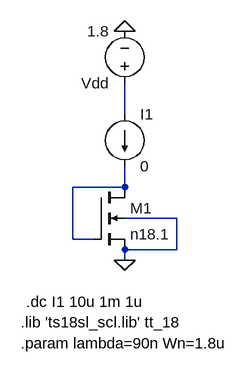
[diagram p0: schematic q2.asc]
q2.asc, the LTspice schematic file:
Version 4.1
SHEET 1 1088 680
WIRE 176 -64 176 -112
WIRE 176 48 176 16
WIRE 176 48 96 48
WIRE 256 96 176 96
WIRE 96 128 96 48
WIRE 128 128 96 128
WIRE 256 144 256 96
WIRE 256 144 176 144
WIRE 176 160 176 144
FLAG 176 -192 0
FLAG 176 160 0
SYMBOL voltage 176 -96 R180
WINDOW 123 0 0 Left 0
WINDOW 39 0 0 Left 0
SYMATTR InstName Vdd
SYMATTR Value 1.8
SYMBOL nmos4 128 48 R0
SYMATTR InstName M1
SYMATTR Value n18.1
SYMATTR Value2 l={2*lambda} w={Wn} ad={5*lambda*Wn} as={5*lambda*Wn} pd={2*Wn + 10*lambda} ps={2*Wn + 10*lambda}
SYMBOL current 176 -64 R0
WINDOW 123 0 0 Left 0
WINDOW 39 0 0 Left 0
SYMATTR InstName I1
SYMATTR Value 0
TEXT 16 288 Left 2 !.param lambda=90n Wn=1.8u
TEXT 16 256 Left 2 !.lib 'ts18sl_scl.lib' tt_18
TEXT 24 224 Left 2 !.dc I1 10u 1m 1u

The netlist it stands for:
* q2.asc
Vdd N001 0 1.8
M1 N002 N002 0 0 n18.1 l={2*lambda} w={Wn} ad={5*lambda*Wn} as={5*lambda*Wn} pd={2*Wn + 10*lambda} ps={2*Wn + 10*lambda}
I1 N001 N002 0
.model NMOS NMOS
.model PMOS PMOS
.lib standard.mos
.param lambda=90n Wn=1.8u
.lib 'ts18sl_scl.lib' tt_18
.dc I1 10u 1m 1u
.backanno
.end